# EAGLE schematic promini (EAGLE 7.4.0)
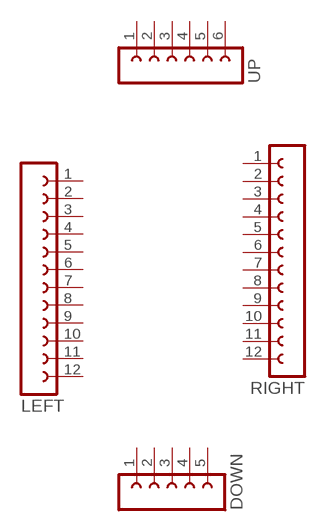
[diagram p0: schematic, sheet 1]

## Parts
DOWN  FE05-1  [FE05-1]
LEFT  FE12-1  [FE12]
RIGHT  FE12-1  [FE12]
UP  FE06-1  [FE06]
Unconnected: DOWN.1 DOWN.2 DOWN.3 DOWN.4 DOWN.5 LEFT.1 LEFT.2 LEFT.3 LEFT.4 LEFT.5 LEFT.6 LEFT.7 LEFT.8 LEFT.9 LEFT.10 LEFT.11 LEFT.12 RIGHT.1 RIGHT.2 RIGHT.3 RIGHT.4 RIGHT.5 RIGHT.6 RIGHT.7 RIGHT.8 RIGHT.9 RIGHT.10 RIGHT.11 RIGHT.12 UP.1 UP.2 UP.3 UP.4 UP.5 UP.6

## Library data of the parts
DOWN = con-lsta:FE05-1: FEMALE HEADER; OC_FARNELL: unknown; OC_NEWARK: unknown
LEFT RIGHT = con-lsta:FE12-1: FEMALE HEADER; OC_FARNELL: unknown; OC_NEWARK: unknown
UP = con-lsta:FE06-1: FEMALE HEADER; OC_FARNELL: unknown; OC_NEWARK: unknown